# Altium schematic sheet logic.SchDoc
size Letter
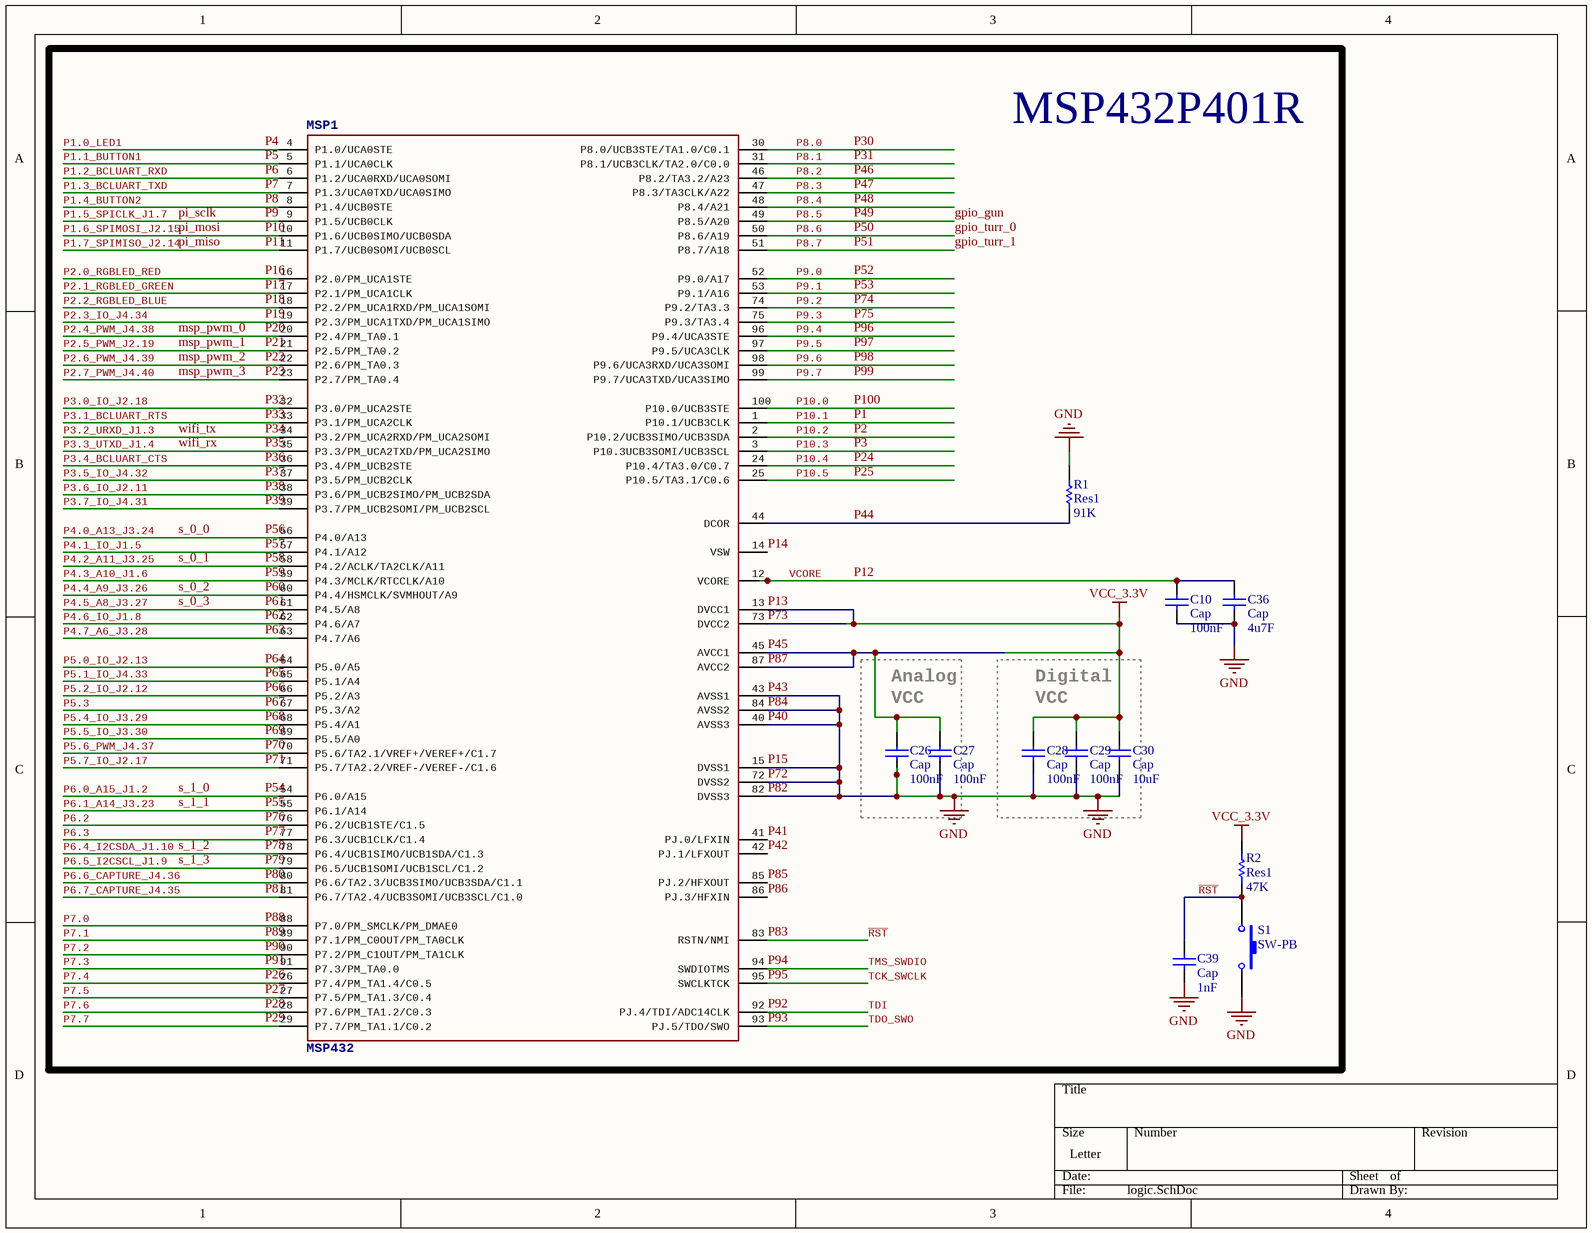
[diagram p0: logic.SchDoc]

## Parts
C10  Cap  value 100nF  [RAD-0.1]
C26  Cap  value 100nF  [RAD-0.1]
C27  Cap  value 100nF  [RAD-0.1]
C28  Cap  value 100nF  [RAD-0.1]
C29  Cap  value 100nF  [RAD-0.1]
C30  Cap  value 10uF  [RAD-0.1]
C36  Cap  value 4u7F  [RAD-0.1]
C39  Cap  value 1nF  [RAD-0.1]
MSP1  MSP432  [PZ100_L]
R1  Res1  value 91K  [AXIAL-0.3]
R2  Res1  value 47K  [AXIAL-0.3]
S1  SW-PB  [SW PB]

## Nets
P13: C26.2 C27.2 C28.2 C29.2 C30.2 MSP1.13(DVCC1) MSP1.45(AVCC1) MSP1.73(DVCC2) MSP1.87(AVCC2) R2.2  [also labelled P45, P73, P87, VCC_3.3V]
P15: C10.1 C26.1 C27.1 C28.1 C29.1 C30.1 C36.1 C39.1 MSP1.15(DVSS1) MSP1.40(AVSS3) MSP1.43(AVSS1) MSP1.72(DVSS2) MSP1.82(DVSS3) MSP1.84(AVSS2) R1.1 S1.2  [also labelled GND, P40, P43, P72, P82, P84]
gpio_gun: MSP1.49(P8.5/A20)  [also labelled P49, P8.5]
gpio_turr_0: MSP1.50(P8.6/A19)  [also labelled P50, P8.6]
gpio_turr_1: MSP1.51(P8.7/A18)  [also labelled P51, P8.7]
msp_pwm_0: MSP1.20(P2.4/PM_TA0.1)  [also labelled P2.4_PWM_J4.38, P20]
msp_pwm_1: MSP1.21(P2.5/PM_TA0.2)  [also labelled P2.5_PWM_J2.19, P21]
msp_pwm_2: MSP1.22(P2.6/PM_TA0.3)  [also labelled P2.6_PWM_J4.39, P22]
msp_pwm_3: MSP1.23(P2.7/PM_TA0.4)  [also labelled P2.7_PWM_J4.40, P23]
P1: MSP1.1(P10.1/UCB3CLK)  [also labelled P10.1]
P1.0_LED1: MSP1.4(P1.0/UCA0STE)  [also labelled P4]
P1.1_BUTTON1: MSP1.5(P1.1/UCA0CLK)  [also labelled P5]
P1.2_BCLUART_RXD: MSP1.6(P1.2/UCA0RXD/UCA0SOMI)  [also labelled P6]
P1.3_BCLUART_TXD: MSP1.7(P1.3/UCA0TXD/UCA0SIMO)  [also labelled P7]
P1.4_BUTTON2: MSP1.8(P1.4/UCB0STE)  [also labelled P8]
P1.5_SPICLK_J1.7: MSP1.9(P1.5/UCB0CLK)  [also labelled P9, pi_sclk]
P1.6_SPIMOSI_J2.15: MSP1.10(P1.6/UCB0SIMO/UCB0SDA)  [also labelled P10, pi_mosi]
P1.7_SPIMISO_J2.14: MSP1.11(P1.7/UCB0SOMI/UCB0SCL)  [also labelled P11, pi_miso]
P3.0_IO_J2.18: MSP1.32(P3.0/PM_UCA2STE)  [also labelled P32]
P3.1_BCLUART_RTS: MSP1.33(P3.1/PM_UCA2CLK)  [also labelled P33]
P3.2_URXD_J1.3: MSP1.34(P3.2/PM_UCA2RXD/PM_UCA2SOMI)  [also labelled P34, wifi_tx]
P3.3_UTXD_J1.4: MSP1.35(P3.3/PM_UCA2TXD/PM_UCA2SIMO)  [also labelled P35, wifi_rx]
P3.4_BCLUART_CTS: MSP1.36(P3.4/PM_UCB2STE)  [also labelled P36]
P3.5_IO_J4.32: MSP1.37(P3.5/PM_UCB2CLK)  [also labelled P37]
P3.6_IO_J2.11: MSP1.38(P3.6/PM_UCB2SIMO/PM_UCB2SDA)  [also labelled P38]
P3.7_IO_J4.31: MSP1.39(P3.7/PM_UCB2SOMI/PM_UCB2SCL)  [also labelled P39]
P4.0_A13_J3.24: MSP1.56(P4.0/A13)  [also labelled P56, s_0_0]
P4.1_IO_J1.5: MSP1.57(P4.1/A12)  [also labelled P57]
P4.2_A11_J3.25: MSP1.58(P4.2/ACLK/TA2CLK/A11)  [also labelled P58, s_0_1]
P4.3_A10_J1.6: MSP1.59(P4.3/MCLK/RTCCLK/A10)  [also labelled P59]
P4.4_A9_J3.26: MSP1.60(P4.4/HSMCLK/SVMHOUT/A9)  [also labelled P60, s_0_2]
P4.5_A8_J3.27: MSP1.61(P4.5/A8)  [also labelled P61, s_0_3]
P4.6_IO_J1.8: MSP1.62(P4.6/A7)  [also labelled P62]
P4.7_A6_J3.28: MSP1.63(P4.7/A6)  [also labelled P63]
P5.0_IO_J2.13: MSP1.64(P5.0/A5)  [also labelled P64]
P5.1_IO_J4.33: MSP1.65(P5.1/A4)  [also labelled P65]
P5.2_IO_J2.12: MSP1.66(P5.2/A3)  [also labelled P66]
P5.3: MSP1.67(P5.3/A2)  [also labelled P67]
P5.4_IO_J3.29: MSP1.68(P5.4/A1)  [also labelled P68]
P5.5_IO_J3.30: MSP1.69(P5.5/A0)  [also labelled P69]
P5.6_PWM_J4.37: MSP1.70(P5.6/TA2.1/VREF+/VEREF+/C1.7)  [also labelled P70]
P5.7_IO_J2.17: MSP1.71(P5.7/TA2.2/VREF-/VEREF-/C1.6)  [also labelled P71]
P6.2: MSP1.76(P6.2/UCB1STE/C1.5)  [also labelled P76]
P6.3: MSP1.77(P6.3/UCB1CLK/C1.4)  [also labelled P77]
P6.4_I2CSDA_J1.10: MSP1.78(P6.4/UCB1SIMO/UCB1SDA/C1.3)  [also labelled P78, s_1_2]
P6.5_I2CSCL_J1.9: MSP1.79(P6.5/UCB1SOMI/UCB1SCL/C1.2)  [also labelled P79, s_1_3]
P6.6_CAPTURE_J4.36: MSP1.80(P6.6/TA2.3/UCB3SIMO/UCB3SDA/C1.1)  [also labelled P80]
P6.7_CAPTURE_J4.35: MSP1.81(P6.7/TA2.4/UCB3SOMI/UCB3SCL/C1.0)  [also labelled P81]
P7.0: MSP1.88(P7.0/PM_SMCLK/PM_DMAE0)  [also labelled P88]
P7.1: MSP1.89(P7.1/PM_C0OUT/PM_TA0CLK)  [also labelled P89]
P7.2: MSP1.90(P7.2/PM_C1OUT/PM_TA1CLK)  [also labelled P90]
P7.3: MSP1.91(P7.3/PM_TA0.0)  [also labelled P91]
P9.4: MSP1.96(P9.4/UCA3STE)  [also labelled P96]
P9.5: MSP1.97(P9.5/UCA3CLK)  [also labelled P97]
P9.6: MSP1.98(P9.6/UCA3RXD/UCA3SOMI)  [also labelled P98]
P9.7: MSP1.99(P9.7/UCA3TXD/UCA3SIMO)  [also labelled P99]
P10.0: MSP1.100(P10.0/UCB3STE)  [also labelled P100]
P10.2: MSP1.2(P10.2/UCB3SIMO/UCB3SDA)  [also labelled P2]
P10.3: MSP1.3(P10.3UCB3SOMI/UCB3SCL)  [also labelled P3]
P10.4: MSP1.24(P10.4/TA3.0/C0.7)  [also labelled P24]
P10.5: MSP1.25(P10.5/TA3.1/C0.6)  [also labelled P25]
P12: C10.2 C36.2 MSP1.12(VCORE)  [also labelled VCORE]
P14: MSP1.14(VSW)
P16: MSP1.16(P2.0/PM_UCA1STE)  [also labelled P2.0_RGBLED_RED]
P17: MSP1.17(P2.1/PM_UCA1CLK)  [also labelled P2.1_RGBLED_GREEN]
P18: MSP1.18(P2.2/PM_UCA1RXD/PM_UCA1SOMI)  [also labelled P2.2_RGBLED_BLUE]
P19: MSP1.19(P2.3/PM_UCA1TXD/PM_UCA1SIMO)  [also labelled P2.3_IO_J4.34]
P26: MSP1.26(P7.4/PM_TA1.4/C0.5)  [also labelled P7.4]
P27: MSP1.27(P7.5/PM_TA1.3/C0.4)  [also labelled P7.5]
P28: MSP1.28(P7.6/PM_TA1.2/C0.3)  [also labelled P7.6]
P29: MSP1.29(P7.7/PM_TA1.1/C0.2)  [also labelled P7.7]
P30: MSP1.30(P8.0/UCB3STE/TA1.0/C0.1)  [also labelled P8.0]
P31: MSP1.31(P8.1/UCB3CLK/TA2.0/C0.0)  [also labelled P8.1]
P41: MSP1.41(PJ.0/LFXIN)
P42: MSP1.42(PJ.1/LFXOUT)
P44: MSP1.44(DCOR) R1.2
P46: MSP1.46(P8.2/TA3.2/A23)  [also labelled P8.2]
P47: MSP1.47(P8.3/TA3CLK/A22)  [also labelled P8.3]
P48: MSP1.48(P8.4/A21)  [also labelled P8.4]
P52: MSP1.52(P9.0/A17)  [also labelled P9.0]
P53: MSP1.53(P9.1/A16)  [also labelled P9.1]
P54: MSP1.54(P6.0/A15)  [also labelled P6.0_A15_J1.2, s_1_0]
P55: MSP1.55(P6.1/A14)  [also labelled P6.1_A14_J3.23, s_1_1]
P74: MSP1.74(P9.2/TA3.3)  [also labelled P9.2]
P75: MSP1.75(P9.3/TA3.4)  [also labelled P9.3]
P83: C39.2 MSP1.83(RSTN/NMI) R2.1 S1.1  [also labelled ~{RST}]
P85: MSP1.85(PJ.2/HFXOUT)
P86: MSP1.86(PJ.3/HFXIN)
P92: MSP1.92(PJ.4/TDI/ADC14CLK)  [also labelled TDI]
P93: MSP1.93(PJ.5/TDO/SWO)  [also labelled TDO_SWO]
P94: MSP1.94(SWDIOTMS)  [also labelled TMS_SWDIO]
P95: MSP1.95(SWCLKTCK)  [also labelled TCK_SWCLK]

## Notes on the sheet
- MSP432P401R
- Analog
- Digital
- VCC

## Library data of the parts
C10 C26-C30 C36 C39 = Cap: Capacitor; Published: 8-Jun-2000; LatestRevisionDate: 17-Jul-2002; LatestRevisionNote: Re-released for DXP Platform.; PackageReference: RAD-0.3; Publisher: Altium Limited; PackageDescription: Radial Cap, Thru-Hole; 2 Leads; 0.3 in Pin Spacing
R1 R2 = Res1: Resistor; Published: 8-Jun-2000; LatestRevisionDate: 17-Jul-2002; LatestRevisionNote: Re-released for DXP Platform.; PackageReference: AXIAL-0.3; Publisher: Altium Limited; PackageDescription: Axial Device, Thru-Hole; 2 Leads; 0.3 in Pin Spacing
S1 = SW-PB_2: DIGIKEY SW400-ND; Published: 24-Mar-1999; LatestRevisionDate: 17-Jul-2002; LatestRevisionNote: Re-released for DXP Platform.; Publisher: Altium Limited